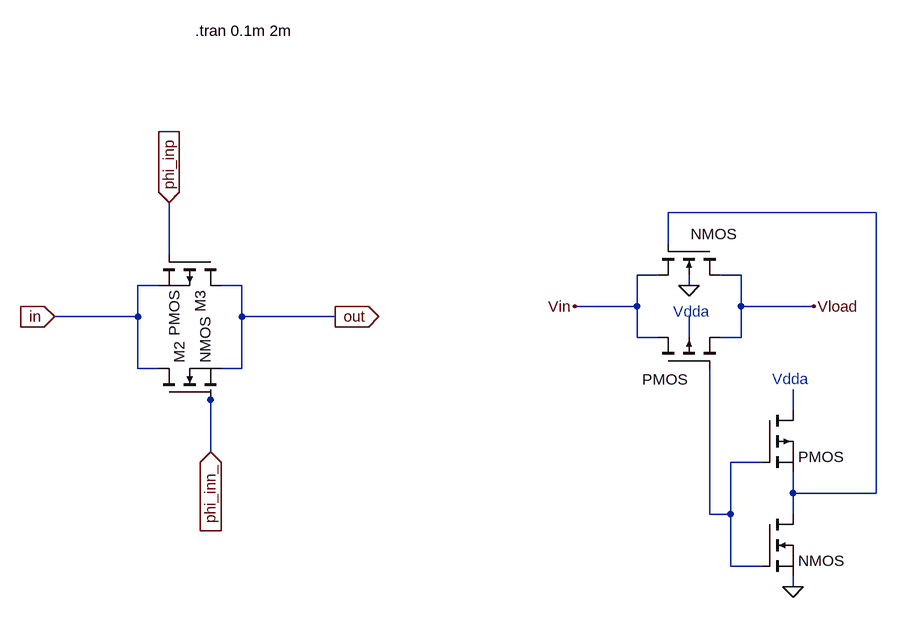
[diagram p0: schematic complementarySwitch.asc]
complementarySwitch.asc, the LTspice schematic file:
Version 4
SHEET 1 1900 864
WIRE 1232 112 912 112
WIRE 912 160 912 112
WIRE 144 176 144 96
WIRE 896 208 864 208
WIRE 1024 208 992 208
WIRE 128 224 96 224
WIRE 256 224 224 224
WIRE 944 224 944 208
WIRE 864 256 864 208
WIRE 864 256 768 256
WIRE 1024 256 1024 208
WIRE 1136 256 1024 256
WIRE 96 272 96 224
WIRE 96 272 -32 272
WIRE 256 272 256 224
WIRE 400 272 256 272
WIRE 864 304 864 256
WIRE 896 304 864 304
WIRE 944 304 944 272
WIRE 1024 304 1024 256
WIRE 1024 304 992 304
WIRE 96 352 96 272
WIRE 128 352 96 352
WIRE 256 352 256 272
WIRE 256 352 224 352
WIRE 208 400 208 384
WIRE 1104 416 1104 384
WIRE 208 480 208 400
WIRE 1056 496 1008 496
WIRE 1104 544 1104 512
WIRE 1232 544 1232 112
WIRE 1232 544 1104 544
WIRE 976 576 976 352
WIRE 1008 576 1008 496
WIRE 1008 576 976 576
WIRE 1104 576 1104 544
WIRE 1008 656 1008 576
WIRE 1056 656 1008 656
WIRE 1104 688 1104 672
FLAG -32 272 in
IOPIN -32 272 In
FLAG 400 272 out
IOPIN 400 272 Out
FLAG 144 96 phi_inp
IOPIN 144 96 In
FLAG 208 480 phi_inn_
IOPIN 208 480 In
FLAG 944 224 0
FLAG 1104 688 0
FLAG 768 256 Vin
FLAG 1136 256 Vload
SYMBOL nmos 128 400 R270
SYMATTR InstName M2
SYMBOL pmos 224 176 R90
SYMATTR InstName M3
SYMBOL nmos4 992 160 R90
WINDOW 0 56 32 Invisible 2
WINDOW 3 -15 -27 VRight 2
SYMATTR InstName M1
SYMBOL pmos4 896 352 R270
WINDOW 0 56 32 Invisible 2
WINDOW 3 -17 -24 VRight 2
SYMATTR InstName M4
SYMBOL pmos 1056 416 R0
WINDOW 0 56 32 Invisible 2
SYMATTR InstName M5
SYMBOL nmos 1056 576 R0
WINDOW 0 56 32 Invisible 2
SYMATTR InstName M6
TEXT 184 -168 Left 2 !.tran 0.1m 2m
TEXT 920 264 Left 2 ;Vdda
TEXT 1072 368 Left 2 ;Vdda

The netlist it stands for:
* complementarySwitch.asc
M2 in phi_inn_ out out NMOS
M3 out phi_inp in in PMOS
M1 Vload N001 Vin 0 NMOS
M4 Vin N004 Vload N002 PMOS
M5 N003 N004 N001 N001 PMOS
M6 N001 N004 0 0 NMOS
.model NMOS NMOS
.model PMOS PMOS
.lib standard.mos
.tran 0.1m 2m
* Vdda
* Vdda
.backanno
.end